# Altium schematic sheet Vertical Switching Board.SchDoc
size 420 x 297 mm; SheetNumber: 2; SheetTotal: 2
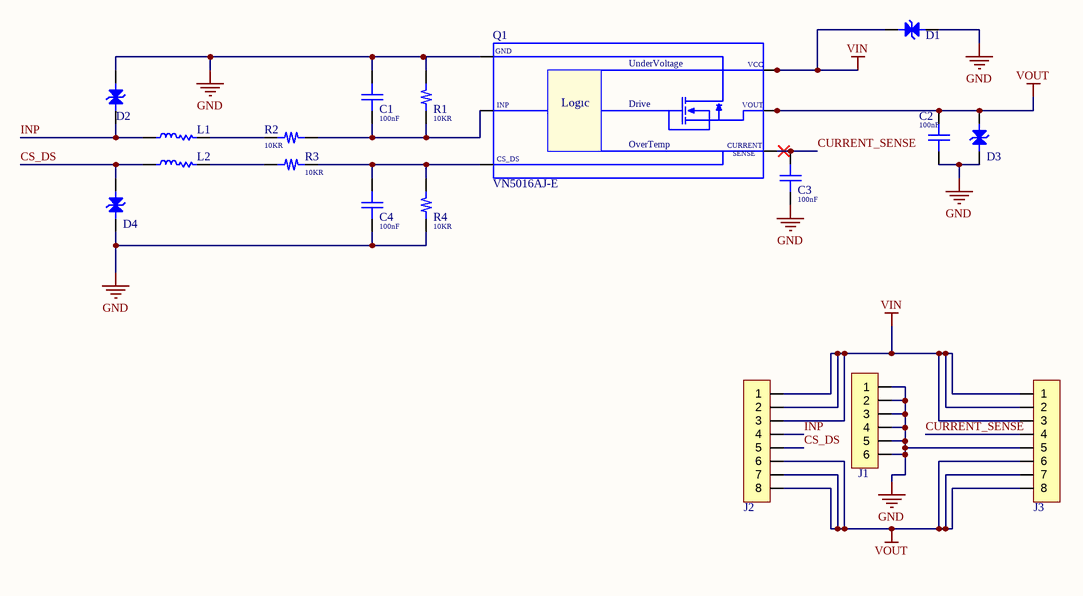
[diagram p0: Vertical Switching Board.SchDoc]

## Parts
C1  value 100nF  [C-0603]  (hidden comment: Cap-0603)
C2  value 100nF  [C-0603]  (hidden comment: Cap-0603)
C3  value 100nF  [C-0603]  (hidden comment: Cap-0603)
C4  value 100nF  [C-0603]  (hidden comment: Cap-0603)
D1  TVS-Diode  [TVS]  (value not drawn)
D2  TVS-Diode  [TVS]  (value not drawn)
D3  TVS-Diode  [TVS]  (value not drawn)
D4  TVS-Diode  [TVS]  (value not drawn)
J1  Conn-6P  [6P-CONN]  (value not drawn)
J2  Conn-8P  [8P-CONN]  (value not drawn)
J3  Conn-8P  [8P-CONN]  (value not drawn)
L1  Ferid-Bead  [FB-0603]  (value not drawn)
L2  Ferid-Bead  [FB-0603]  (value not drawn)
Q1  VN5016AJ-E  [PowerSSO-12]
R1  value 10KR  [R-0603]  (hidden comment: Res-0603)
R2  value 10KR  [R-0603]  (hidden comment: Res-0603)
R3  value 10KR  [R-0603]  (hidden comment: Res-0603)
R4  value 10KR  [R-0603]  (hidden comment: Res-0603)

## Nets
GND: C1.2 C2.1 C3.1 C4.1 D1.2 D2.2 D3.1 D4.1 J1.1 J1.2 J1.3 J1.4 J1.5 J1.6 J3.5 Q1.2(GND) R1.2 R4.1
VIN: D1.1 J2.1 J2.2 J2.3 J3.1 J3.2 J3.3 Q1.1(VCC) Q1.6(VCC)
VOUT: C2.2 D3.2 J2.6 J2.7 J2.8 J3.6 J3.7 J3.8 Q1.7(OUT) Q1.8(OUT) Q1.9(OUT) Q1.10(OUT) Q1.11(OUT) Q1.12(OUT)
CS_DS: D4.2 J2.5 L2.1
CURRENT_SENSE: C3.2 J3.4 Q1.4(CURRENT_SENSE)
INP: D2.1 J2.4 L1.1
NetC1_1: C1.1 Q1.3(INP) R1.1 R2.2
NetC4_2: C4.2 Q1.5(CS_DC) R3.2 R4.2
NetL1_2: L1.2 R2.1
NetL2_2: L2.2 R3.1

## Notes on the sheet
- REVİSİON
- DESCRIPTION
- DATE
- APPROVED
- DWG NO:
- TAINIM/DESCRIPTION
- REV:
- DOSYA ADI/FİLE NAME
- HAZIRLAYAN/PREPARED BY
- KONTROL EDEN/ CHECKED BY
- YAYIN TARİHİ/REL. DATE
- DEĞ TARİHİ/CHANCE DATE
- ONAYLAYAN/APPROVED BY
- REVİZYON/REVISION
- Arda Bozkurt
- BÖLÜM/DEPARTMENT
- BOYUT/SİZE
- SAYFA/SHEET
- of
- (in symbol VN5016AJ-E) UnderVoltage; Logıc; Drive; VOUT; OverTemp; CURRENT; SENSE; CS_DS